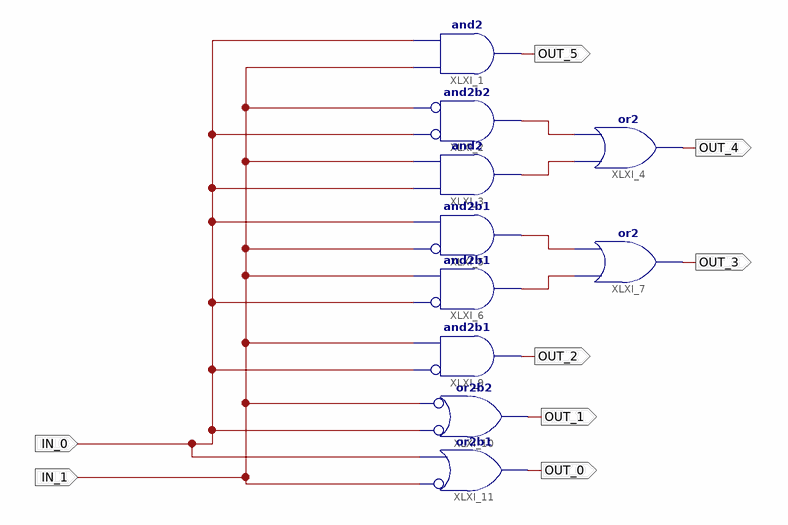
[diagram p0: schematic sheet 1]
// Xilinx ISE schematic l1.sch (spartan3a) as structural Verilog: 10 symbols, 8 ports
module l1 (
  input  IN_0,
  input  IN_1,
  output OUT_5,
  output OUT_4,
  output OUT_3,
  output OUT_2,
  output OUT_1,
  output OUT_0
);

  wire XLXN_4, XLXN_5, XLXN_7, XLXN_8;

  and XLXI_1 (OUT_5, IN_1, IN_0);
  and XLXI_2 (XLXN_4, ~IN_0, ~IN_1);  // and2b2
  and XLXI_3 (XLXN_5, IN_0, IN_1);
  or XLXI_4 (OUT_4, XLXN_5, XLXN_4);
  and XLXI_5 (XLXN_7, ~IN_1, IN_0);  // and2b1
  and XLXI_6 (XLXN_8, ~IN_0, IN_1);  // and2b1
  or XLXI_7 (OUT_3, XLXN_8, XLXN_7);
  and XLXI_9 (OUT_2, ~IN_0, IN_1);  // and2b1
  or XLXI_10 (OUT_1, ~IN_0, ~IN_1);  // or2b2
  or XLXI_11 (OUT_0, ~IN_1, IN_0);  // or2b1
endmodule
